# Altium schematic sheet PSU (Power Supply Unit).SchDoc
size A; SheetNumber: 3; SheetTotal: 5; SPICEModelCacheLFJWHGAS: <root> / <DocumentId>LFJWHGAS</DocumentId> / <CacheFrame Number="0"> / <Model Name="diode" Kind="MDL"> / <Text>.MODEL diode D ()</Text> / </Model> / </CacheFrame> / </root>
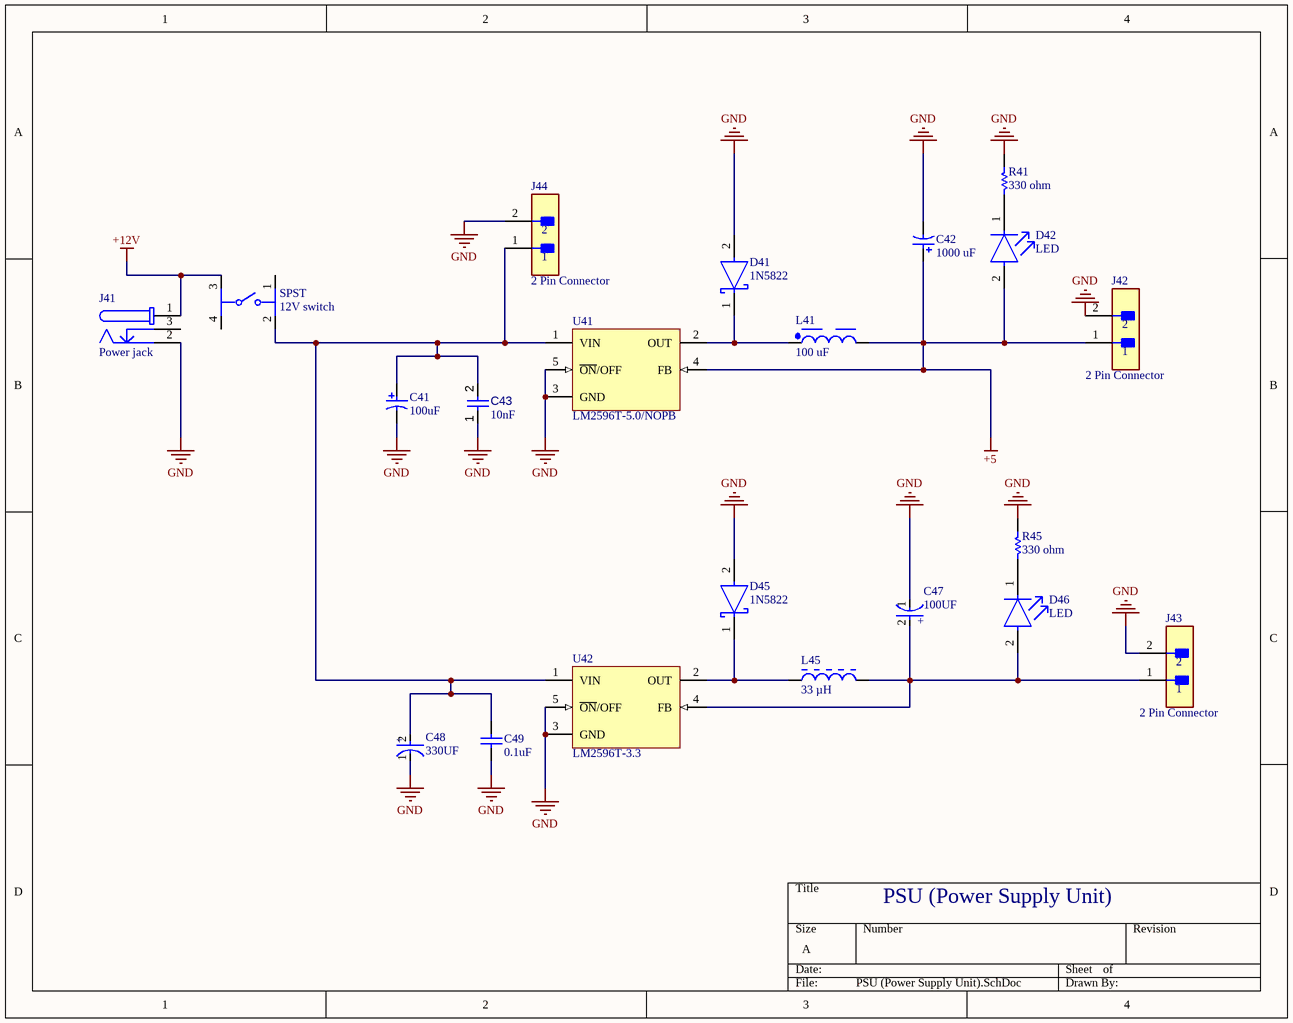
[diagram p0: PSU (Power Supply Unit).SchDoc]

## Parts
C41  100uF  [PNSC-FK-V-D8_V]
C42  1000 uF  [PNSC-FR-A-8X20-2_V]
C43  value 10nF  [CAPC0402(1005)60_L]  (hidden comment: Capacitor 10nF +/-20% 50V 0402)
C47  100UF  [FP-SC-MFG]
C48  330UF  [FP-FTG-MFG]
C49  0.1uF  [CAPC1005X55X30LL05T10]
D41  1N5822  [FP-DO-201AD-MFG]
D42  LED  [FP-LTST-S270KRKT-MFG]
D45  1N5822  [FP-DO-201AD-MFG]
D46  LED  [FP-LTST-S270KRKT-MFG]
J41  Power jack  [694106301002]
J42  2 Pin Connector  [FP-53048-0210-MFG]
J43  2 Pin Connector  [FP-53048-0210-MFG]
J44  2 Pin Connector  [FP-53048-0210-MFG]
L41  100 uF  [WE-PD2_5848]
L45  33 µH  [BOUR-SRN3015-2_V]
R41  330 ohm  [RESC1608X55X30LL15T15]
R45  330 ohm  [RESC1608X55X30LL15T15]
SPST  12V switch  [FP-PTS645SM43SMTR92LFS-MFG]
U41  LM2596T-5.0/NOPB  [NDH0005A]
U42  LM2596T-3.3  [T05D]

## Nets
+5: C42.1 D42.2(A) J42.1 L41.2 U41.4(FB)
+12V: J41.1 SPST.3
GND: C41.2 C42.2 C43.1 C47.1(C) C48.1(C) C49.1 D41.2(A) D45.2(A) J41.2 J42.2 J43.2 J44.2 R41.1 R45.1 U41.3(GND) U41.5(~{ON}/OFF) U42.3(GND) U42.5(~{ON}/OFF)
NetC41_1: C41.1 C43.2 C48.2(A) C49.2 J44.1 SPST.2 U41.1(VIN) U42.1(VIN)
NetC47_2: C47.2(A) D46.2(A) J43.1 L45.2 U42.4(FB)
NetD41_1: D41.1(C) L41.1 U41.2(OUT)
NetD42_1: D42.1(C) R41.2
NetD45_1: D45.1(C) L45.1 U42.2(OUT)
NetD46_1: D46.1(C) R45.2

Not connected (* = marked no-connect by the designer): J41 3; SPST 1 4

## Notes on the sheet
- PSU (Power Supply Unit)
- (in symbol CMP-05427-000047-1) +
- (in symbol CMP-05427-000081-1) +

## Library data of the parts
C41 = CMP-2000-06206-1: Aluminum Electrolytic Capacitor, 100 uF, +/- 20%, 25 V, 2-Pin SMD (Size Code D8), -55 to 105 degC, RoHS, Tape and Reel; Manufacturer: Panasonic; Type: Can; Lifetime@Temperature: 2000Hrs@105°C; Capacitance: 100µF; Rated Voltage: 25V; Ripple Current: 280mA; Impedance: 0.34O; Value: 100µF; Case Size/Dimension: Ø6.3x7.7mm; Operating Temp-Max: 105°C; Series: FK; Package URL: http://industrial.panasonic.com/cdbs/www-data/pdf/RDE0000/DME0000COL48.pdf; Mounting Technology: SurfaceMount; Package Description: 2-Pin Electrolytic Aluminum Capacitor, Body 6.6 x 6.6 mm; Datasheet Version: 03/2016; Datasheet URL: http://industrial.panasonic.com/cdbs/www-data/pdf/RDE0000/ABA0000C1181.pdf; Manufacturer URL: http://www.panasonic.com/; Package Reference: FK-V-D8; Operating Temp Range: -55to+105°C
C42 = CMP-0744-00002-1: Aluminum Electrolytic Capacitor, 1000 uF +/- 20%, 16 V, -40 to 105 degC, 2-Pin THD, Dia 8 mm, Body Length 22 mm, RoHS; PartNumber: EEU-FR1C102L; Manufacturer: Panasonic; Rated Voltage: 16 V; Resistance: 0.03 Ohm; Tolerance: +/- 20%; Rated Ripple Current: 1560 mA; ComponentLink2URL: http://www.panasonic.com/industrial/includes/pdf/EEU-FR_DataSheet.pdf; DatasheetVersion: Apr-10; Temperature Range: -40 to 105 degC; ComponentLink1Description: Manufacturer URL; ComponentLink1URL: http://www.panasonic.com/industrial/electronic-components/; PackageDescription: 2-Pin Radial Lead, Dia 8 mm, Body Length 22 mm, Pin Spacing 3.5 mm; PackageReference: FR-A-8X20-2; Mounting Technology: Through Hole; RoHS: TRUE; ComponentLink2Description: Datasheet; Capacitance: 1000 uF; Value: 1000 uF
C43 = CMP-001-00069-3: Chip Capacitor, 10nF +/-20%, 50V, 0402, Thickness 0.6 mm; Tolerance: 5%; Max Operating Temperature: 85°C; Pins: 2; Case/Package: 0402; Voltage Rating: 50V; Min Operating Temperature: -55°C; Mounting Technology: SMT
C47 = CMP-05427-000047-1: CAP ALUM 100UF 20% 10V SMD; Life (Hours): 1000Hour; Ripple Current: 50mA; Packaging: Tape and Reel; Diameter: 5mm; Voltage Rating (DC): 10V; Mount: Surface Mount; Max Operating Temperature: 85°C; Length: 5.5mm; Case/Package: Radial; Height: 5.4mm; Construction: Cylindrical; Termination: SMD/SMT; Height - Seated (Max): 0.213inch; Series: S; Min Operating Temperature: -40°C; Capacitance: 100uF; Tolerance: 20%; Voltage Rating: 10V; Package Quantity: 1; Radiation Hardening: No; Ripple Current (AC): 50mA; Lead Free: Lead Free; RoHS Compliant: Yes; Contact Plating: Tin
C48 = CMP-05427-000081-1: CAP ALUM 330UF 20% 50V SMD; Ripple Current: 900mA; Polarity: Polar; Dielectric Material: Aluminium; ESR (Equivalent Series Resistance): 120mR; Leakage Current: 165uA; Lead Diameter: 0.9mm; Life (Hours): 2000Hour; Height: 10.2mm; Case/Package: Radial; Height - Seated (Max): 0.413inch; Max Operating Temperature: 105°C; Min Operating Temperature: -55°C; Tolerance: 20%; Capacitance: 330uF; Voltage Rating: 50V; Package Quantity: 500; Series: FT; Lead Pitch: 4.6mm; Construction: Cylindrical; Mount: Surface Mount; REACH SVHC: No SVHC; Voltage Rating (DC): 50V; Ripple Current (AC): 900mA; Radiation Hardening: No; Contact Plating: Tin; Voltage: 50V; Packaging: Tape and Reel; Lead Free: Lead Free; Length: 10.2mm; RoHS Compliant: Yes; Number of Pins: 2; Diameter: 10mm; Termination: SMD/SMT
C49 = CMP-0001-00074-2: Manufacturer: Kemet; Part Number: C0402C104K4RACTU
D41 D45 = CMP-12187-000025-1: DIODE SCHOTTKY 40V 3A DO201AD; Manufacturer: STMicroelectronics; Max Junction Temp: +150°C; Peak Reverse Current: 2mA; Max Surge Forward Current: 80A; Temperature Range High: +150°C; Automotive: No; RoHS: TRUE; ComponentLink2Description: Datasheet; Manufacturer Part Number: 1N5822; Lead Free: Yes; Octopart: https://octopart.com/1n5822-stmicroelectronics-323225; Device Class L2: Diodes; Max Repetitive Reverse Voltage: 40V; Temperature: to +150°C; Height: 5.3mm; Category: Diode; Digikey Description: DIODE SCHOTTKY 40V 3A DO201AD; ComponentLink2URL: https://www.st.com/resource/en/datasheet/1n5822.pdf; Device Class L3: Schottky Diodes; Device Class L1: Discrete Semiconductors; Forward Current: 3A; Mouser Description: Schottky Diodes & Rectifiers Vr/40V Io/3A BULK; Package: DO-201AD
D42 D46 = CMP-2000-06630-2: LED RED CLEAR CHIP SMD R/A; Test Current: 20mA; Number of LEDs: 1; Power Rating: 75mW; Lens Style: Diffused; Luminous Intensity: 54mcd; Wavelength: 639nm; Dominant Wavelength: 631nm; Lens Color: Colorless; Forward Voltage: 2V; Viewing Angle: 130°; Forward Current: 30mA; Reverse Voltage: 5V; Illumination Color: Red; Case Code (Imperial): 0603; Color: Red; Packaging: Tape and Reel; Number of Pins: 2; Length: 1.6mm; Lens Transparency: Clear; Width: 1.15mm; Power Dissipation: 75mW; Lead Free: Lead Free; Max Power Dissipation: 75mW; Case/Package: 0603; Max Operating Temperature: 85°C; Mount: Surface Mount; Depth: 0.6mm; Number of Elements: 1; Radiation Hardening: No; Case Code (Metric): 1608; Package Quantity: 1; Height: 0.6mm; Min Operating Temperature: -55°C
J41 = CMP-1502-00188-2: NexarPartId: 52676100; Voltage Rating (DC): 20V; Gender: Male; Voltage Rating: 24V; Insulation Resistance: 100MΩ; Current Rating: 5A; Shielding: Unshielded; Number of Contacts: 3; Color: Black; Housing Material: Polyamide; Contact Gender: Female; Connector Type: Power; REACH SVHC: Unknown; Termination: Through Hole; Height: 11mm; RoHS: Compliant; Mount: Through Hole; Flammability Rating: UL94 V-0; Packaging: Bulk; Min Operating Temperature: -40°C; Contact Plating: Tin; Max Operating Temperature: 85°C; Operating Supply Voltage: 24V; Contact Material: Gold, Tin
J42-J44 = CMP-04776-000546-1: CONN HEADER R/A 2POS 1.25MM; Number of Contacts: 2; Gender: Male; Contact Resistance: 20mR; Current Rating: 1A; Voltage Rating: 125V; Insulation Resistance: 100MR; Glow Wire Compliant: Non-compliant; Flammability Rating: UL94 V-0; Housing Color: Natural; Lead Free: Lead Free; Packaging: Tray; Max Operating Temperature: 85°C; Package Quantity: 5000; Housing Material: Nylon; Radiation Hardening: No; Series: PicoBlade; Termination: Through Hole; RoHS Compliant: Yes; Contact Material: Bronze; Number of Circuits: 2; Number of Rows: 1; Min Operating Temperature: -40°C; Mount: Through Hole; Number of Positions: 2; Pitch: 1.25mm; Voltage Rating (DC): 125V; Color: Natural; Orientation: Right Angle; Contact Plating: Tin
L41 = CMP-0227-00441-2: NexarPartId: 22864967; Inductance Tolerance: 10%; Self Resonant Frequency: 7MHz; DC Resistance (DCR): 510mΩ; Current Rating: 570mA; Inductance: 100µH; Value: 100µH; Height: 4.5mm; Max Operating Temperature: 125°C; Ambient Temperature Range High: 85°C; RoHS: Compliant; Resistance: 510mΩ; Min Operating Temperature: -40°C; Ambient Temperature Range Low: -40°C; Packaging: Digi-Reel®; Width: 5.8mm; Length: 5.2mm; Number of Pins: 2
L45 = CMP-0007-00002-1: Semi-shielded Power Inductor, 33 uH, +/- 20%, 0.5 A, -40 to 125 degC, 3 x 3 x 1.5 mm SMD, RoHS and Halogen Free, Tape and Reel; PartNumber: SRN3015-330M; Manufacturer: Bourns; DCR Max: 0.959 Ohm; Resistance to Solder Heat: +260 degC for 10 sec.; Inductance: 33 uH; Isat: 0.46 A; Rated current: 0.5 A; SRF Min: 22 MHz; Inductance tolerance: +/- 20%; Packing: Tape and Reel; PackageDescription: 2-Pin SMD, Body 3 x 3 mm, Height 1.5 mm; Operating Temperature: -40 to 125 degC; Mounting Technology: Surface Mount; ComponentLink3Description: Package Specification; DatasheetVersion: Aug-11; ComponentLink3URL: http://www.bourns.com/data/global/pdfs/SRN3015.pdf; RoHS: TRUE; ComponentLink2Description: Datasheet; ComponentLink2URL: http://www.bourns.com/data/global/pdfs/SRN3015.pdf; ComponentLink1Description: Manufacturer URL; PackageReference: SRN3015; ComponentLink1URL: http://www.bourns.com/
R41 R45 = CMP-2000-00435-2: Chip Resistor, 330 Ohm, +/- 1%, 0.1 W, -55 to 155 degC, 0603 (1608 Metric), RoHS, Tape and Reel; Gender: Male; Mating Cycles: 10000; Current Rating: 500 mA; Voltage Rating: 10 V; REACH SVHC: No SVHC; PackageDescription: 2-Pin Surface Mount Device, Body 1.6 x 0.85 mm; Contact Finish: Gold; Pins: 8; ComponentLink1Description: Manufacturer URL; Packaging: Tape and Reel; Max Operating Temperature: 85 degC; Contact Material: Copper; Height: 1.45 mm; Width: 1.45 mm; DatasheetVersion: Apr-15; Package Quantity: 1500; Contact Plating: Gold; PackageReference: 0603; Mount: Surface Mount; Lead Pitch: 1.1 mm; Min Operating Temperature: -25 degC; ComponentLink1URL: http://www.panasonic.com/; ComponentLink2URL: http://industrial.panasonic.com/cdbs/www-data/pdf/RDA0000/AOA0000C86.pdf; Length: 13.7 mm; ComponentLink2Description: Datasheet; RoHSCompliant: true
SPST = CMP-2000-05160-2: SWITCH TACTILE SPST-NO 0.05A 12V; Contact Resistance: 100mR; Throw Configuration: SPST; Illumination Type: Non-Illuminated; Mechanical Life: 100000Cycles; Current Rating: 50mA; Switch Function: Off-Mom; Actuator Length: 0.85mm; Actuator Material: Nylon; Actuator Type: Standard; Operating Force: 160gf; Min Operating Temperature: -20°C; REACH SVHC: No SVHC; Termination: Gull Wing; Case/Package: SMD/SMT; Packaging: Tape and Reel; Mount: Surface Mount; Voltage Rating (DC): 12V; Orientation: Straight; Lead Free: Lead Free; Contact Material: Silver; Color: Black; Max Current Rating: 50mA; Contact Plating: Silver; Depth: 9mm; Package Quantity: 1; Max Voltage Rating (DC): 12V; Length: 6mm; Max Operating Temperature: 60°C
U41 = CMP-0069-01926-3: SIMPLE SWITCHER® Power Converter 150 KHz 3A Step-Down Voltage Regulator, 5-pin TO-220, Pb-Free; Manufacturer: Texas Instruments; PowerWise: N; PackageTopMarking: NSUZXYTTE#*LM2596T*-5.0 P+; ComponentLink1URL: http://www.ti.com/general/docs/lit/getliterature.tsp?genericPartNumber=LM2596&fileType=pdf; PackageDescription: TO-220, Molded, Stagger Bend, 5 Lead; ComponentLink1Description: Datasheet URL; PinCount: 5; RoHS: Y; CompType: Switcher; PackageReference: NDH0005A
U42 = CMP-0069-01929-2: SIMPLE SWITCHER® Power Converter 150 KHz 3A Step-Down Voltage Regulator, 5-pin TO-220; Manufacturer: National Semiconductor; PackageTopMarking: NSUZXYTTE#*LM2596T*-3.3 P+; PowerWise: N; CompType: Switcher; ComponentLink1URL: http://www.national.com/ds/LM/LM2596.pdf; ComponentLink2URL: http://www.national.com/pf/LM/LM2596.html; RoHS: N; RevisionNote: Component URLs added; PackageVersion: revA, Oct-1989; ComponentLink1Description: LM2596 Datasheet; DatasheetVersion: May-2002; ComponentLink3URL: http://www.national.com/packaging/folders/t05d.html; PackageDescription: TO-220, Molded, Stagger Bend, 5 Lead; ComponentLink3Description: T05D Package Page; PackageReference: T05D; PinCount: 5; ComponentLink2Description: LM2596 Web Page